# EAGLE schematic boardv2 (EAGLE 8.6.0)
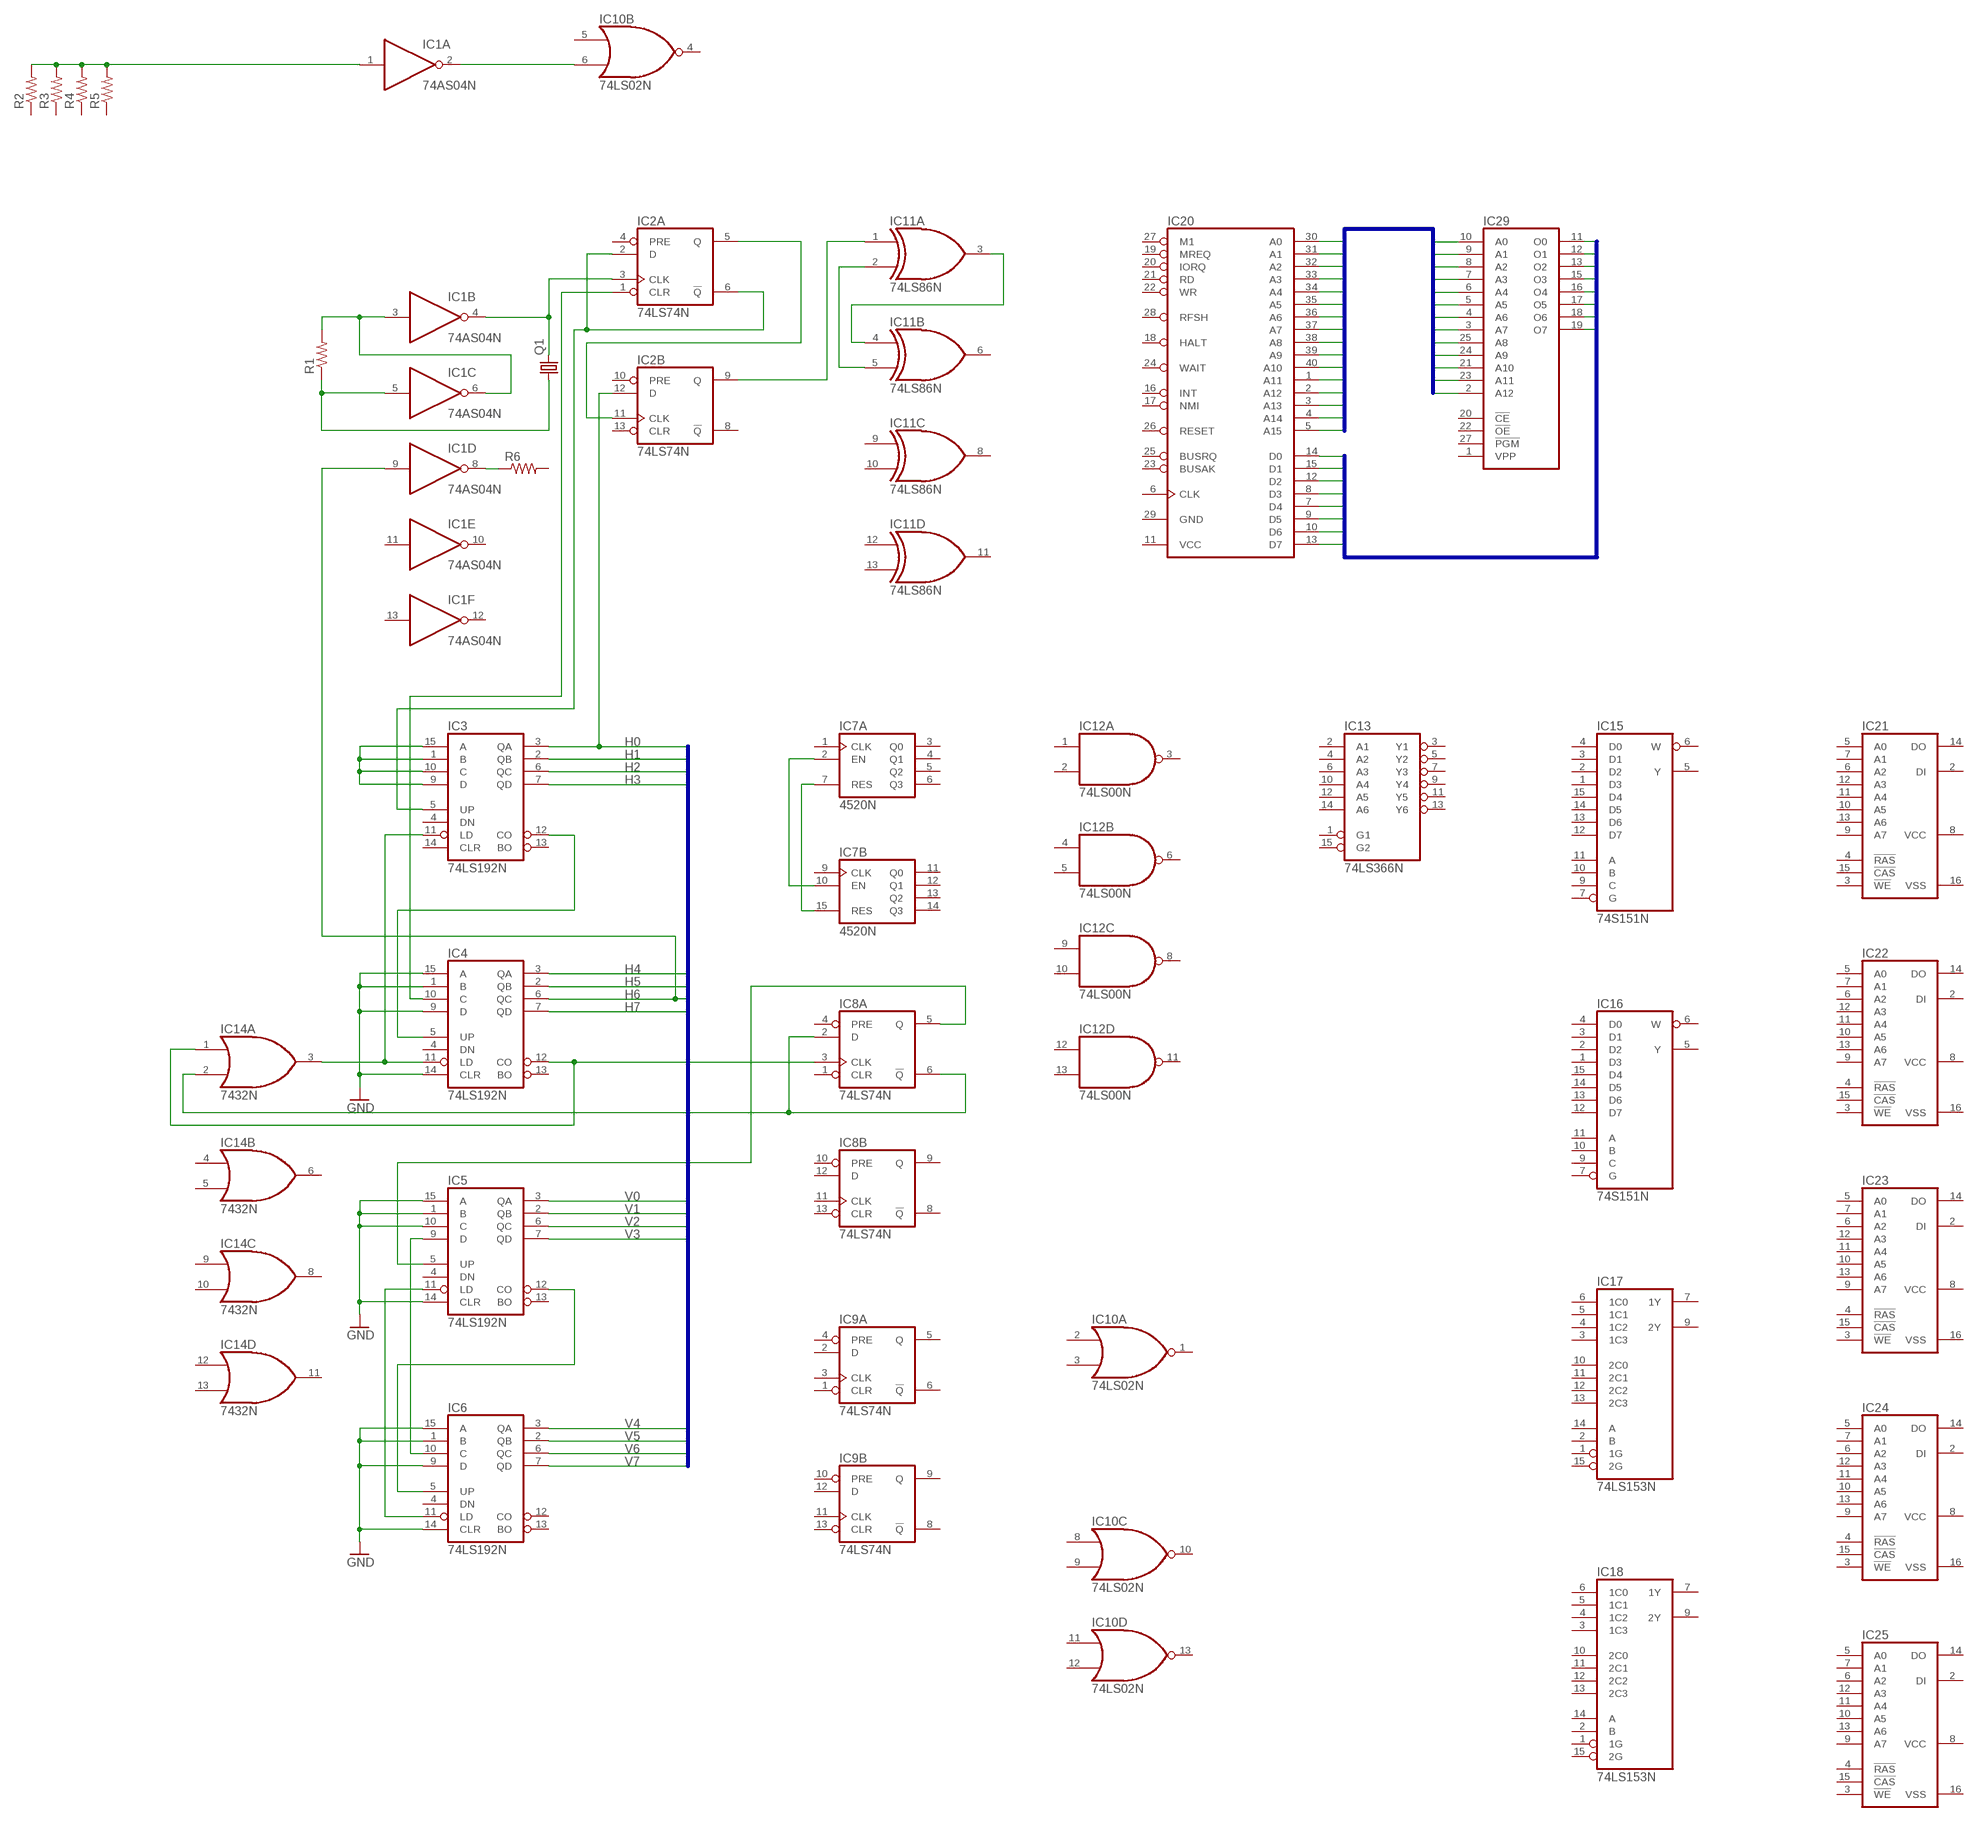
[diagram p0: schematic, sheet 1, part 1 of 2]
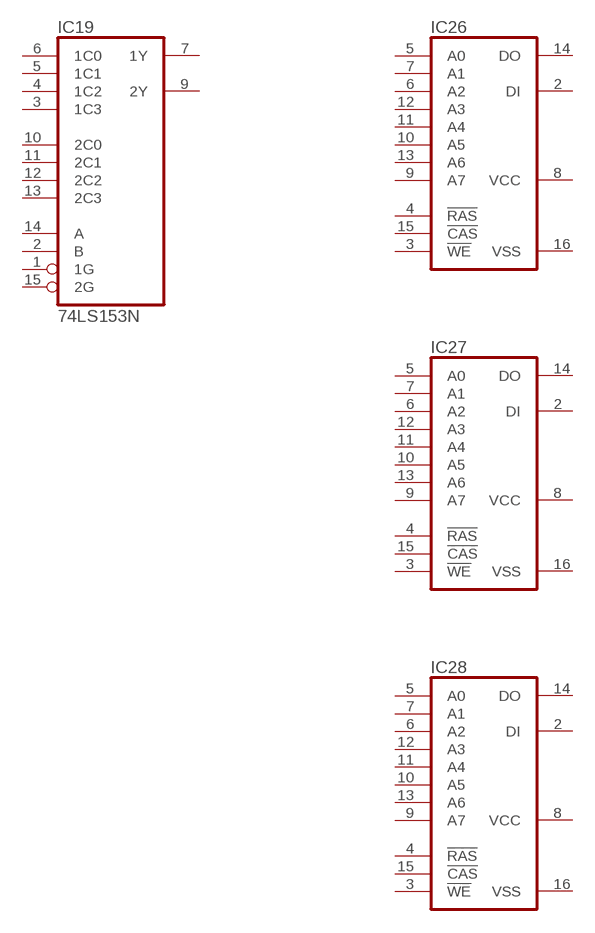
[diagram p1: schematic, sheet 1, part 2 of 2]

## Parts
IC1  74AS04N  [DIL14]
IC2  74LS74N  [DIL14]
IC3  74LS192N  [DIL16]
IC4  74LS192N  [DIL16]
IC5  74LS192N  [DIL16]
IC6  74LS192N  [DIL16]
IC7  4520N  [DIL16]
IC8  74LS74N  [DIL14]
IC9  74LS74N  [DIL14]
IC10  74LS02N  [DIL14]
IC11  74LS86N  [DIL14]
IC12  74LS00N  [DIL14]
IC13  74LS366N  [DIL16]
IC14  7432N  [DIL14]
IC15  74S151N  [DIL16]
IC16  74S151N  [DIL16]
IC17  74LS153N  [DIL16]
IC18  74LS153N  [DIL16]
IC19  74LS153N  [DIL16]
IC20  Z80CPU  [DIL40]
IC21  2164  [DIL16]
IC22  2164  [DIL16]
IC23  2164  [DIL16]
IC24  2164  [DIL16]
IC25  2164  [DIL16]
IC26  2164  [DIL16]
IC27  2164  [DIL16]
IC28  2164  [DIL16]
IC29  2764  [DIL28]
Q1  CRYSTALHC49S  [HC49/S]
R1  R-US_0207/10  [0207/10]
R2  R-US_0207/10  [0207/10]
R3  R-US_0207/10  [0207/10]
R4  R-US_0207/10  [0207/10]
R5  R-US_0207/10  [0207/10]
R6  R-US_0207/10  [0207/10]

## Nets
A0: IC20.30(A0) IC29.10(A0)
A1: IC20.31(A1) IC29.9(A1)
A2: IC20.32(A2) IC29.8(A2)
A3: IC20.33(A3) IC29.7(A3)
A4: IC20.34(A4) IC29.6(A4)
A5: IC20.35(A5) IC29.5(A5)
A6: IC20.36(A6) IC29.4(A6)
A7: IC20.37(A7) IC29.3(A7)
A8: IC20.38(A8) IC29.25(A8)
A9: IC20.39(A9) IC29.24(A9)
A10: IC20.40(A10) IC29.21(A10)
A11: IC20.1(A11) IC29.23(A11)
A12: IC20.2(A12) IC29.2(A12)
A13: IC20.3(A13)
A14: IC20.4(A14)
A15: IC20.5(A15)
D0: IC20.14(D0) IC29.11(O0)
D1: IC20.15(D1) IC29.12(O1)
D2: IC20.12(D2) IC29.13(O2)
D3: IC20.8(D3) IC29.15(O3)
D4: IC20.7(D4) IC29.16(O4)
D5: IC20.9(D5) IC29.17(O5)
D6: IC20.10(D6) IC29.18(O6)
D7: IC20.13(D7) IC29.19(O7)
GND: IC4.1(B) IC4.9(D) IC4.14(CLR) IC4.15(A) IC5.1(B) IC5.10(C) IC5.14(CLR) IC5.15(A) IC6.1(B) IC6.9(D) IC6.14(CLR) IC6.15(A)
H0: IC2.12(B:D) IC3.3(QA)
H1: IC3.2(QB)
H2: IC3.6(QC)
H3: IC3.7(QD)
H4: IC4.3(QA)
H5: IC4.2(QB)
H6: IC1.9(D:I) IC4.6(QC)
H7: IC4.7(QD)
N$1: IC1.3(B:I) IC1.6(C:O) R1.2
N$2: IC1.5(C:I) Q1.1 R1.1
N$3: IC1.4(B:O) IC2.3(A:CLK) Q1.2
N$4: IC2.5(A:Q) IC2.11(B:CLK)
N$5: IC2.2(A:D) IC2.6(A:!Q) IC3.5(UP)
N$6: IC3.1(B) IC3.9(D) IC3.10(C) IC3.15(A)
N$7: IC5.12(CO) IC6.5(UP)
N$8: IC4.12(CO) IC8.3(A:CLK) IC14.1(A:I0)
N$9: IC3.12(CO) IC4.5(UP)
N$10: IC7.2(A:EN) IC7.10(B:EN)
N$11: IC7.7(A:RES) IC7.15(B:RES)
N$12: IC11.3(A:O) IC11.4(B:I0)
N$13: IC11.2(A:I1) IC11.5(B:I1)
N$14: IC2.9(B:Q) IC11.1(A:I0)
N$15: IC2.1(A:CLR) IC4.10(C)
N$16: IC3.11(LD) IC4.11(LD) IC14.3(A:O)
N$17: IC8.2(A:D) IC8.6(A:!Q) IC14.2(A:I1)
N$18: IC5.5(UP) IC8.5(A:Q)
N$19: IC1.1(A:I) R2.2 R3.2 R4.2 R5.2
N$20: IC1.2(A:O) IC10.6(B:I1)
N$22: IC5.9(D) IC6.10(C)
N$23: IC1.8(D:O) R6.1
N$24: IC5.11(LD) IC6.11(LD)
V0: IC5.3(QA)
V1: IC5.2(QB)
V2: IC5.6(QC)
V3: IC5.7(QD)
V4: IC6.3(QA)
V5: IC6.2(QB)
V6: IC6.6(QC)
V7: IC6.7(QD)
Unconnected: IC1.10(E:O) IC1.11(E:I) IC1.12(F:O) IC1.13(F:I) IC2.4(A:PRE) IC2.8(B:!Q) IC2.10(B:PRE) IC2.13(B:CLR) IC3.4(DN) IC3.13(BO) IC3.14(CLR) IC4.4(DN) IC4.13(BO) IC5.4(DN) IC5.13(BO) IC6.4(DN) IC6.12(CO) IC6.13(BO) IC7.1(A:CLK) IC7.3(A:Q0) IC7.4(A:Q1) IC7.5(A:Q2) IC7.6(A:Q3) IC7.9(B:CLK) IC7.11(B:Q0) IC7.12(B:Q1) IC7.13(B:Q2) IC7.14(B:Q3) IC8.1(A:CLR) IC8.4(A:PRE) IC8.8(B:!Q) IC8.9(B:Q) IC8.10(B:PRE) IC8.11(B:CLK) IC8.12(B:D) IC8.13(B:CLR) IC9.1(A:CLR) IC9.2(A:D) IC9.3(A:CLK) IC9.4(A:PRE) IC9.5(A:Q) IC9.6(A:!Q) IC9.8(B:!Q) IC9.9(B:Q) IC9.10(B:PRE) IC9.11(B:CLK) IC9.12(B:D) IC9.13(B:CLR) IC10.1(A:O) IC10.2(A:I0) IC10.3(A:I1) IC10.4(B:O) IC10.5(B:I0) IC10.8(C:I0) IC10.9(C:I1) IC10.10(C:O) IC10.11(D:I0) IC10.12(D:I1) IC10.13(D:O) IC11.6(B:O) IC11.8(C:O) IC11.9(C:I0) IC11.10(C:I1) IC11.11(D:O) IC11.12(D:I0) IC11.13(D:I1) IC12.1(A:I0) IC12.2(A:I1) IC12.3(A:O) IC12.4(B:I0) IC12.5(B:I1) IC12.6(B:O) IC12.8(C:O) IC12.9(C:I0) IC12.10(C:I1) IC12.11(D:O) IC12.12(D:I0) IC12.13(D:I1) IC13.1(G1) IC13.2(A1) IC13.3(Y1) IC13.4(A2) IC13.5(Y2) IC13.6(A3) IC13.7(Y3) IC13.9(Y4) IC13.10(A4) IC13.11(Y5) IC13.12(A5) IC13.13(Y6) IC13.14(A6) IC13.15(G2) IC14.4(B:I0) IC14.5(B:I1) IC14.6(B:O) IC14.8(C:O) IC14.9(C:I0) IC14.10(C:I1) IC14.11(D:O) IC14.12(D:I0) IC14.13(D:I1) IC15.1(D3) IC15.2(D2) IC15.3(D1) IC15.4(D0) IC15.5(Y) IC15.6(W) IC15.7(G) IC15.9(C) IC15.10(B) IC15.11(A) IC15.12(D7) IC15.13(D6) IC15.14(D5) IC15.15(D4) IC16.1(D3) IC16.2(D2) IC16.3(D1) IC16.4(D0) IC16.5(Y) IC16.6(W) IC16.7(G) IC16.9(C) IC16.10(B) IC16.11(A) IC16.12(D7) IC16.13(D6) IC16.14(D5) IC16.15(D4) IC17.1(1G) IC17.2(B) IC17.3(1C3) IC17.4(1C2) IC17.5(1C1) IC17.6(1C0) IC17.7(1Y) IC17.9(2Y) IC17.10(2C0) IC17.11(2C1) IC17.12(2C2) IC17.13(2C3) IC17.14(A) IC17.15(2G) IC18.1(1G) IC18.2(B) IC18.3(1C3) IC18.4(1C2) IC18.5(1C1) IC18.6(1C0) IC18.7(1Y) IC18.9(2Y) IC18.10(2C0) IC18.11(2C1) IC18.12(2C2) IC18.13(2C3) IC18.14(A) IC18.15(2G) IC19.1(1G) IC19.2(B) IC19.3(1C3) IC19.4(1C2) IC19.5(1C1) IC19.6(1C0) IC19.7(1Y) IC19.9(2Y) IC19.10(2C0) IC19.11(2C1) IC19.12(2C2) IC19.13(2C3) IC19.14(A) IC19.15(2G) IC20.6(CLK) IC20.16(INT) IC20.17(NMI) IC20.18(HALT) IC20.19(MREQ) IC20.20(IORQ) IC20.21(RD) IC20.22(WR) IC20.23(BUSAK) IC20.24(WAIT) IC20.25(BUSRQ) IC20.26(RESET) IC20.27(M1) IC20.28(RFSH) IC21.2(DI) IC21.3(!WE) IC21.4(!RAS) IC21.5(A0) IC21.6(A2) IC21.7(A1) IC21.9(A7) IC21.10(A5) IC21.11(A4) IC21.12(A3) IC21.13(A6) IC21.14(DO) IC21.15(!CAS) IC22.2(DI) IC22.3(!WE) IC22.4(!RAS) IC22.5(A0) IC22.6(A2) IC22.7(A1) IC22.9(A7) IC22.10(A5) IC22.11(A4) IC22.12(A3) IC22.13(A6) IC22.14(DO) IC22.15(!CAS) IC23.2(DI) IC23.3(!WE) IC23.4(!RAS) IC23.5(A0) IC23.6(A2) IC23.7(A1) IC23.9(A7) IC23.10(A5) IC23.11(A4) IC23.12(A3) IC23.13(A6) IC23.14(DO) IC23.15(!CAS) IC24.2(DI) IC24.3(!WE) IC24.4(!RAS) IC24.5(A0) IC24.6(A2) IC24.7(A1) IC24.9(A7) IC24.10(A5) IC24.11(A4) IC24.12(A3) IC24.13(A6) IC24.14(DO) IC24.15(!CAS) IC25.2(DI) IC25.3(!WE) IC25.4(!RAS) IC25.5(A0) IC25.6(A2) IC25.7(A1) IC25.9(A7) IC25.10(A5) IC25.11(A4) IC25.12(A3) IC25.13(A6) IC25.14(DO) IC25.15(!CAS) IC26.2(DI) IC26.3(!WE) IC26.4(!RAS) IC26.5(A0) IC26.6(A2) IC26.7(A1) IC26.9(A7) IC26.10(A5) IC26.11(A4) IC26.12(A3) IC26.13(A6) IC26.14(DO) IC26.15(!CAS) IC27.2(DI) IC27.3(!WE) IC27.4(!RAS) IC27.5(A0) IC27.6(A2) IC27.7(A1) IC27.9(A7) IC27.10(A5) IC27.11(A4) IC27.12(A3) IC27.13(A6) IC27.14(DO) IC27.15(!CAS) IC28.2(DI) IC28.3(!WE) IC28.4(!RAS) IC28.5(A0) IC28.6(A2) IC28.7(A1) IC28.9(A7) IC28.10(A5) IC28.11(A4) IC28.12(A3) IC28.13(A6) IC28.14(DO) IC28.15(!CAS) IC29.1(VPP) IC29.20(!CE) IC29.22(!OE) IC29.27(!PGM) R2.1 R3.1 R4.1 R5.1 R6.2

## Buses
VIDEO:H[0..7],V[0..7]
ADDRESS:A[0..15]
DATA:D[0..7]

## Power pins joined to a net without a drawn wire
GND: IC1.7(P:GND) IC2.7(P:GND) IC3.8(GND) IC4.8(GND) IC5.8(GND) IC6.8(GND) IC8.7(P:GND) IC9.7(P:GND) IC10.7(P:GND) IC11.7(P:GND) IC12.7(P:GND) IC13.8(GND) IC14.7(P:GND) IC15.8(GND) IC16.8(GND) IC17.8(GND) IC18.8(GND) IC19.8(GND) IC20.29(GND) IC29.14(GND)
VCC: IC1.14(P:VCC) IC2.14(P:VCC) IC3.16(VCC) IC4.16(VCC) IC5.16(VCC) IC6.16(VCC) IC8.14(P:VCC) IC9.14(P:VCC) IC10.14(P:VCC) IC11.14(P:VCC) IC12.14(P:VCC) IC13.16(VCC) IC14.14(P:VCC) IC15.16(VCC) IC16.16(VCC) IC17.16(VCC) IC18.16(VCC) IC19.16(VCC) IC20.11(VCC) IC21.8(VCC) IC22.8(VCC) IC23.8(VCC) IC24.8(VCC) IC25.8(VCC) IC26.8(VCC) IC27.8(VCC) IC28.8(VCC) IC29.28(VCC)
VDD: IC7.16(P:VDD)
VSS: IC7.8(P:VSS) IC21.16(VSS) IC22.16(VSS) IC23.16(VSS) IC24.16(VSS) IC25.16(VSS) IC26.16(VSS) IC27.16(VSS) IC28.16(VSS)

## Library data of the parts
IC1 = 74xx-us:74*04: Hex INVERTER
IC2 IC8 IC9 = 74xx-us:74*74: Dual D type positive edge triggered FLIP FLOP, preset and clear
IC3-IC6 = 74xx-us:74*192: Synchronous 4-bit UP/DOWN COUNTER
IC7 = 45xx:4520: Dual binary up COUNTER
IC10 = 74xx-us:74*02: Quad 2-input NOR gate
IC11 = 74xx-us:74*86: Quad 2-input EXCLUSIV-OR (XOR) gate
IC12 = 74xx-us:74*00: Quad 2-input NAND gate
IC13 = 74xx-us:74*366: Hex BUS DRIVER, 3-state
IC14 = 74xx-us:74*32: Quad 2-input OR gate
IC15 IC16 = 74xx-us:74*151: Data SELECTOR/MULTIPLEXER
IC17-IC19 = 74xx-us:74*153: Dual 4-line to 1-line data SELECTOR/MULTIPLEXER
IC20 = zilog:Z80CPU: Z80 FAMILY DEVICE
IC21-IC28 = memory:2164: MEMORY
IC29 = memory:2764: MEMORY
Q1 = crystal:CRYSTAL: CRYSTAL; OC_FARNELL: 1667008; OC_NEWARK: unknown
R1-R6 = resistor:R-US_: RESISTOR, American symbol